# Altium schematic sheet Sheet.SchDoc
size A4
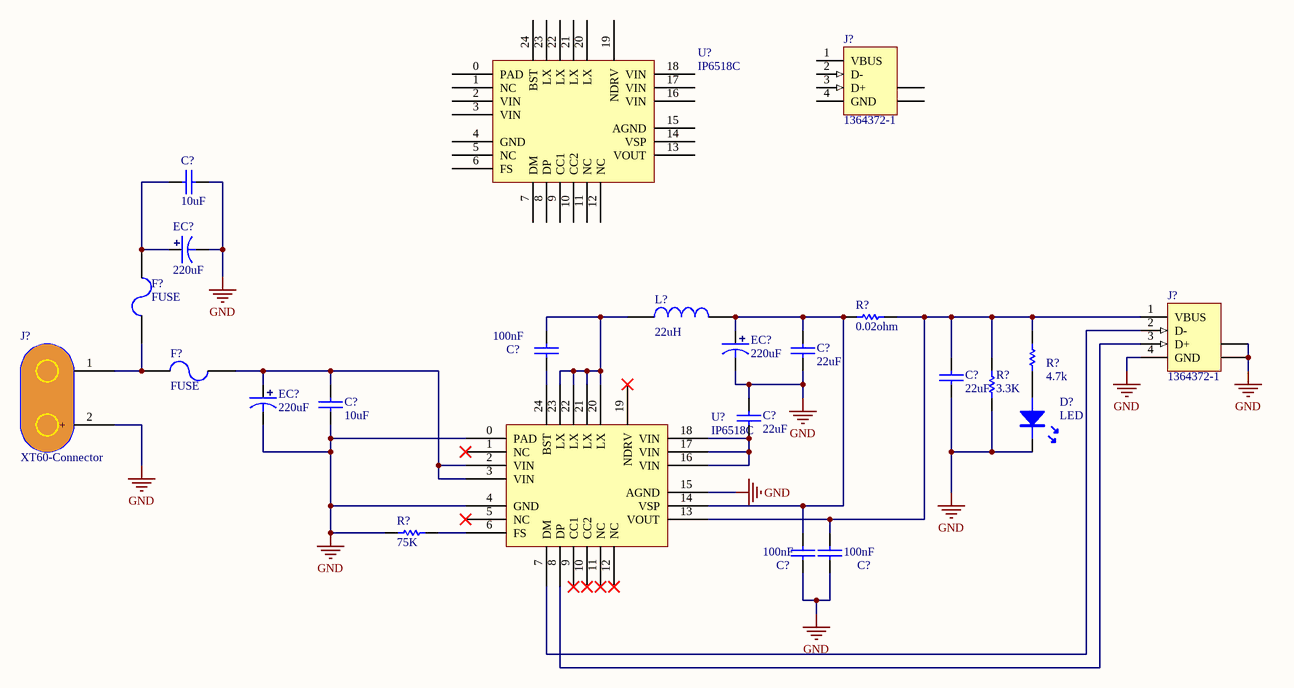
[diagram p0: Sheet.SchDoc]

## Parts
(Parts that share a designator on the sheet are numbered #1, #2 ... from top to bottom, then left to right.)
C?#1  10uF  [0805C]
C?#2  100nF  [0805C]
C?#3  22uF  [0805C]
C?#4  22uF  [0805C]
C?#5  10uF  [0805C]
C?#6  22uF  [0805C]
C?#7  100nF  [0805C]
C?#8  100nF  [0805C]
D?  LED  [LED-0805R]
EC?#1  220uF  [SMD-EC10X10X10]
EC?#2  220uF  [SMD-EC10X10X10]
EC?#3  220uF  [SMD-EC10X10X10]
F?#1  FUSE  [FUSE-1812]
F?#2  FUSE  [FUSE-1812]
J?#1  1364372-1  [440068]
J?#2  1364372-1  [440068]
J?#3  XT60-Connector  [TX60PW-M20]
L?  22uH  [AL0204]
R?#1  0.02ohm  [0805R]
R?#2  4.7k  [0805R]
R?#3  3.3K  [0805R]
R?#4  75K  [0805R]
U?#1  IP6518C  [QFN24]
U?#2  IP6518C  [QFN24]

## Nets
GND: C?#1.1 C?#3.1 C?#4.1 C?#5.1 C?#6.2 C?#7.1 C?#8.1 D?.K EC?#1.2 EC?#2.2 EC?#3.2 J?#2.4(GND) J?#2.5(SHLD) J?#2.6(SHLD) J?#3.2(+) R?#3.1 R?#4.1 U?#2.0(PAD) U?#2.4(GND) U?#2.15(AGND)
NetC?#1_2: C?#1.2 EC?#1.1 F?#1.2
NetC?#2_1: C?#2.1 U?#2.24(BST)
NetC?#2_2: C?#2.2 L?.1 U?#2.20(LX) U?#2.21(LX) U?#2.22(LX) U?#2.23(LX)
NetC?#3_2: C?#3.2 C?#7.2 EC?#2.1 L?.2 R?#1.1 U?#2.14(VSP)
NetC?#4_2: C?#4.2 C?#8.2 J?#2.1(VBUS) R?#1.2 R?#2.2 R?#3.2 U?#2.13(VOUT)
NetC?#5_2: C?#5.2 EC?#3.1 F?#2.1 U?#2.2(VIN) U?#2.3(VIN)
NetC?#6_1: C?#6.1 U?#2.16(VIN) U?#2.17(VIN) U?#2.18(VIN)
NetD?_A: D?.A R?#2.1
NetF?#1_1: F?#1.1 F?#2.2 J?#3.1
NetJ?#2_2: J?#2.2(D-) U?#2.7(DM)
NetJ?#2_3: J?#2.3(D+) U?#2.8(DP)
NetR?#4_2: R?#4.2 U?#2.6(FS)

Not connected (* = marked no-connect by the designer): J?#1 1(VBUS) 2(D-) 3(D+) 4(GND) 5(SHLD) 6(SHLD); U?#1 0(PAD) 1(NC) 2(VIN) 3(VIN) 4(GND) 5(NC) 6(FS) 7(DM) 8(DP) 9(CC1) 10(CC2) 11(NC) 12(NC) 13(VOUT) 14(VSP) 15(AGND) 16(VIN) 17(VIN) 18(VIN) 19(NDRV) 20(LX) 21(LX) 22(LX) 23(LX) 24(BST); U?#2 1(NC)* 5(NC)* 9(CC1)* 10(CC2)* 11(NC)* 12(NC)* 19(NDRV)*

## Library data of the parts
C?#1-C?#8 = CAP: 无极性电容
EC?#1-EC?#3 = SMD_ECAP: 贴片电解电容
J?#1 J?#2 = 1364372-1: USB 1.1, Right Angle, Thru-Hole, A Type, Receptacle, 4 Position, Black; ContactMaterial: Copper Alloy; ContactPlating: Gold (30) over Palladium Nickel; TerminationLength: 2.84mm [0.112in.]; PCB_Layout: Complies with manufacturer's recommendation.; DrillSize: Corresponds to nominal value.; PanelGround: Without; Published: 15-Jul-2004; DatasheetDocument: 11-Jan-2004; PackageDocument: 11-Jan-2004; PackageReference: 1364372; Publisher: Altium Limited; HousingMaterial: Thermoplastic; ComponentLink1Description: Manufacturer Link; ComponentLink1URL: http://www.tycoelectronics.com/; ComponentLink2Description: Packaging Specification; ComponentLink2URL: http://ecommas.tycoelectronics.com/commerce/DocumentDelivery/DDEController?Action=showdoc&DocId=Customer+Drawing%7F1364372%7FD%7Ftif%7FEnglish%7FENG_CD_1364372_D.tif
J?#3 = Component_1: 对于母头，+-对调
L? = INDUCTOR
R?#1-R?#4 = RES